# EAGLE schematic awecont_shield_schematic (EAGLE 6.1)
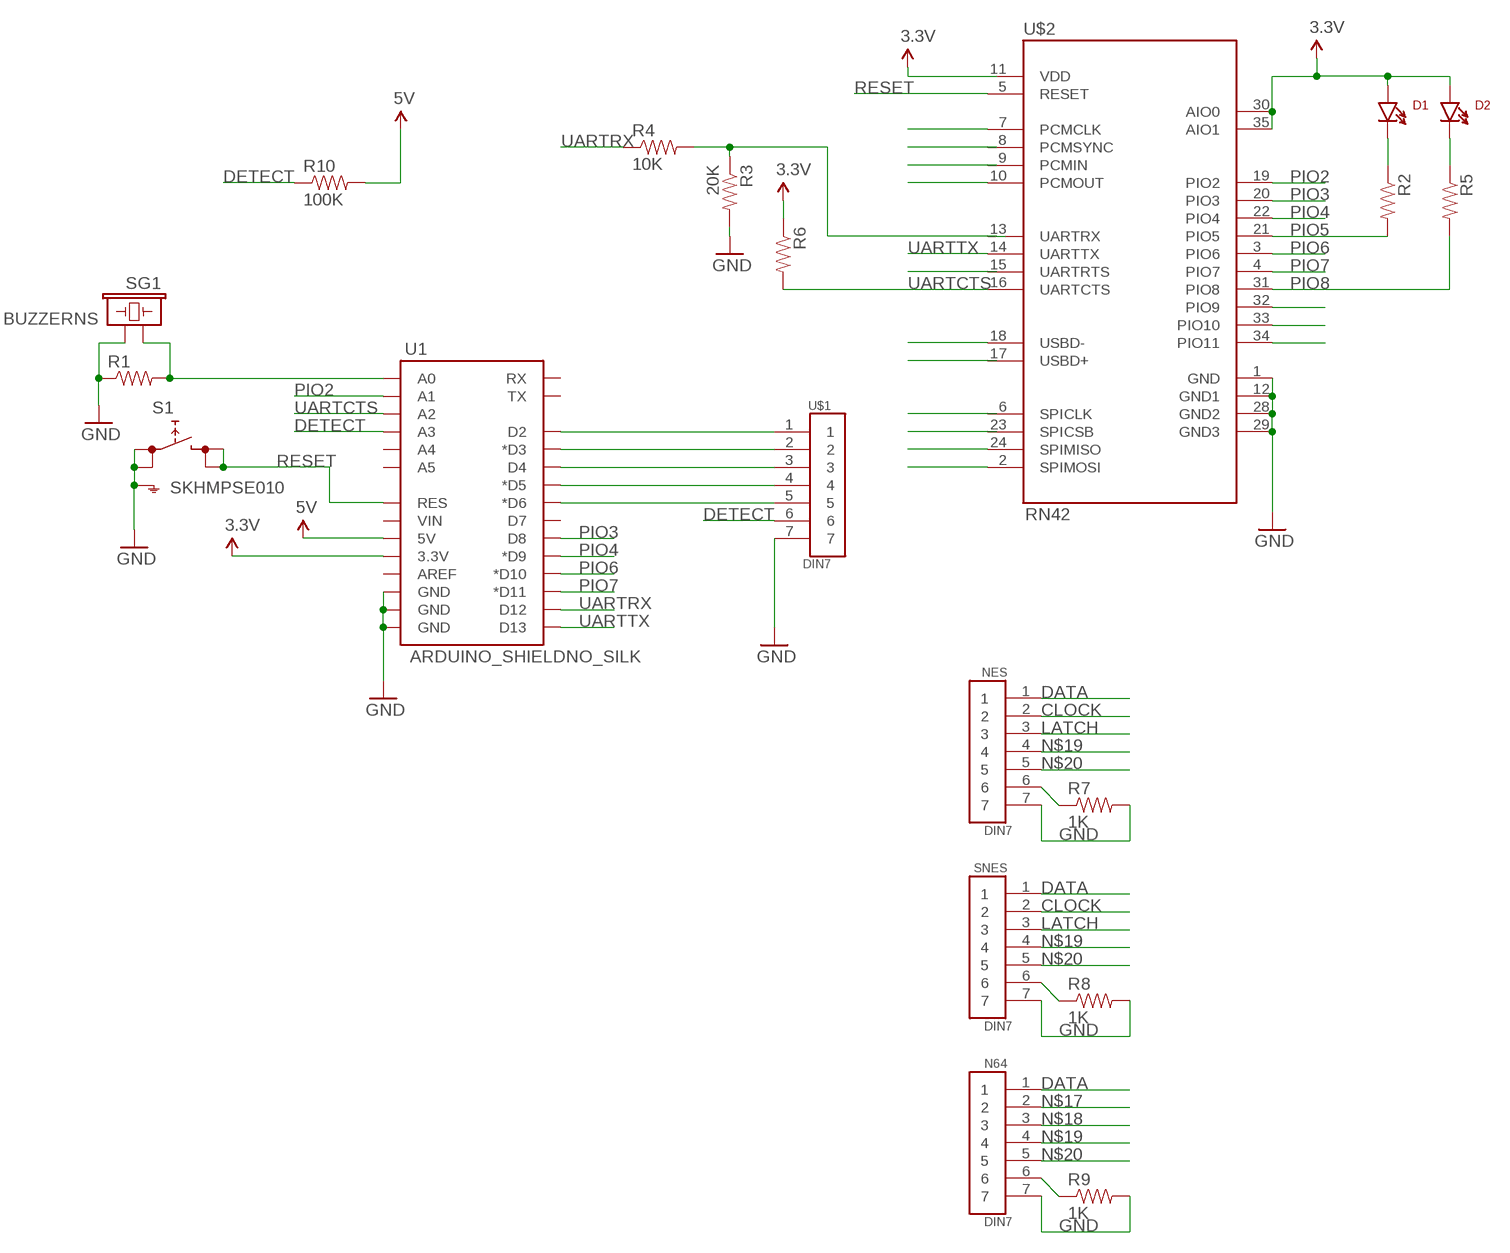
[diagram p0: schematic, sheet 1]

## Parts
D1  LTE-302  [LTE-302]
D2  LTE-302  [LTE-302]
N64  DIN7  [DIN7]
NES  DIN7  [DIN7]
R1  RESISTORAXIAL-0.3  [AXIAL-0.3]
R2  RESISTORAXIAL-0.3  [AXIAL-0.3]
R3  20K  RESISTORAXIAL-0.3  [AXIAL-0.3]
R4  10K  RESISTORAXIAL-0.3  [AXIAL-0.3]
R5  RESISTORAXIAL-0.3  [AXIAL-0.3]
R6  RESISTORAXIAL-0.3  [AXIAL-0.3]
R7  1K  RESISTORAXIAL-0.3  [AXIAL-0.3]
R8  1K  RESISTORAXIAL-0.3  [AXIAL-0.3]
R9  1K  RESISTORAXIAL-0.3  [AXIAL-0.3]
R10  100K  RESISTORAXIAL-0.3  [AXIAL-0.3]
S1  SKHMPSE010  [SKHMPXE010]
SG1  BUZZERNS  [BUZZER-12MM-NS]
SNES  DIN7  [DIN7]
U1  ARDUINO_SHIELDNO_SILK  [DUEMILANOVE_VIAS]
U$1  DIN7  [DIN7]
U$2  RN42  [RN42]

## Nets
3.3V: D1.A D2.A R6.P$1 U1.3.3V U$2.30(AIO0) U$2.35(AIO1)
5V: R10.P$2 U1.5V
CLOCK: NES.2 SNES.2
DATA: N64.1 NES.1 SNES.1
DETECT: R10.P$1 U1.A3 U$1.6
GND: N64.7 NES.7 R1.P$1 R3.P$2 R7.P$2 R8.P$2 R9.P$2 S1.1(1.1) S1.2(1.2) S1.5(SH) SG1.- SNES.7 U1.GND@0(GND) U1.GND@1(GND) U1.GND@2(GND) U$1.7 U$2.1(GND) U$2.12(GND1) U$2.28(GND2) U$2.29(GND3)
LATCH: NES.3 SNES.3
N$1: U1.D2 U$1.1
N$2: U1.D3(*D3) U$1.2
N$3: U1.D4 U$1.3
N$4: U1.D5(*D5) U$1.4
N$5: U1.D6(*D6) U$1.5
N$7: NES.6 R7.P$1
N$8: R1.P$2 SG1.+ U1.A0
N$9: D1.C R2.P$1
N$10: R8.P$1 SNES.6
N$11: N64.6 R9.P$1
N$13: U$2.7(PCMCLK)
N$16: U$2.10(PCMOUT)
N$17: N64.2
N$18: N64.3 R3.P$1 R4.P$2
N$19: N64.4 NES.4 SNES.4
N$20: N64.5 NES.5 SNES.5
N$21: D2.C R5.P$1
N$25: U$2.24(SPIMISO)
N$26: U$2.2(SPIMOSI)
N$27: U$2.18(USBD-)
PIO2: U1.A1 U$2.19(PIO2)
PIO3: U1.D8 U$2.20(PIO3)
PIO4: U1.D9(*D9) U$2.22(PIO4)
PIO5: R2.P$2 U$2.21(PIO5)
PIO6: U1.D10(*D10) U$2.3(PIO6)
PIO7: U1.D11(*D11) U$2.4(PIO7)
PIO8: R5.P$2 U$2.31(PIO8)
PIO9: U$2.32(PIO9)
PIO10: U$2.33(PIO10)
PIO11: U$2.34(PIO11)
RESET: S1.3(2.1) S1.4(2.2) U1.RES U$2.5(RESET)
UARTCTS: R6.P$2 U1.A2 U$2.16(UARTCTS)
UARTRX: R4.P$1 U1.D12
UARTTX: U1.D13 U$2.14(UARTTX)
Unconnected: U1.A4 U1.A5 U1.AREF U1.D7 U1.RX U1.TX U1.VIN U$2.6(SPICLK) U$2.8(PCMSYNC) U$2.9(PCMIN) U$2.11(VDD) U$2.13(UARTRX) U$2.15(UARTRTS) U$2.17(USBD+) U$2.23(SPICSB)

## Library data of the parts
D1 D2 = SparkFun-LED:LTE-302: Through-hole side-firing 940nm IR LED
N64 NES SNES U$1 = SparkFun-Connectors:DIN7: Mini-DIN7 connector
R1-R10 = SparkFun-Passives:RESISTOR: Resistor Basic schematic elements and footprints for 0603, 1206, and PTH resistors.
S1 = switch:SKHMP*E010: 6.2 X 6.5mm TACT Switch (SMD) Source: http://www3.alps.co.jp/WebObjects/catalog.woa/PDF/E/Switch/Tact/SKHM/SKHM.PDF
SG1 = SparkFun-Electromechanical:BUZZER: Buzzer 12mm Spark Fun Electronics SKU : Comp-Buzzer
U1 = SparkFun-Boards:ARDUINO_SHIELD: Arduino shield footprint
U$2 = WirelessHandSensor:RN42